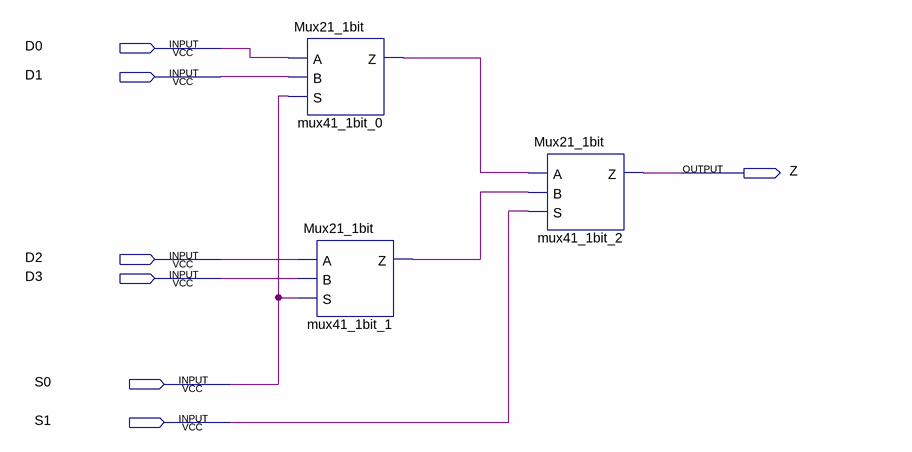
[diagram p0: schematic sheet]
// Quartus schematic Mux41_1bit.bdf as structural Verilog: 3 symbols, 7 pins
module Mux41_1bit (
  input  D0,
  input  D1,
  input  D2,
  input  D3,
  input  S0,
  input  S1,
  output Z
);

  wire mux41_1bit_0_z, mux41_1bit_1_z;

  Mux21_1bit mux41_1bit_0 (.A(D0), .B(D1), .S(S0), .Z(mux41_1bit_0_z));
  Mux21_1bit mux41_1bit_1 (.A(D2), .B(D3), .S(S0), .Z(mux41_1bit_1_z));
  Mux21_1bit mux41_1bit_2 (.A(mux41_1bit_0_z), .B(mux41_1bit_1_z), .S(S1), .Z(Z));
endmodule
